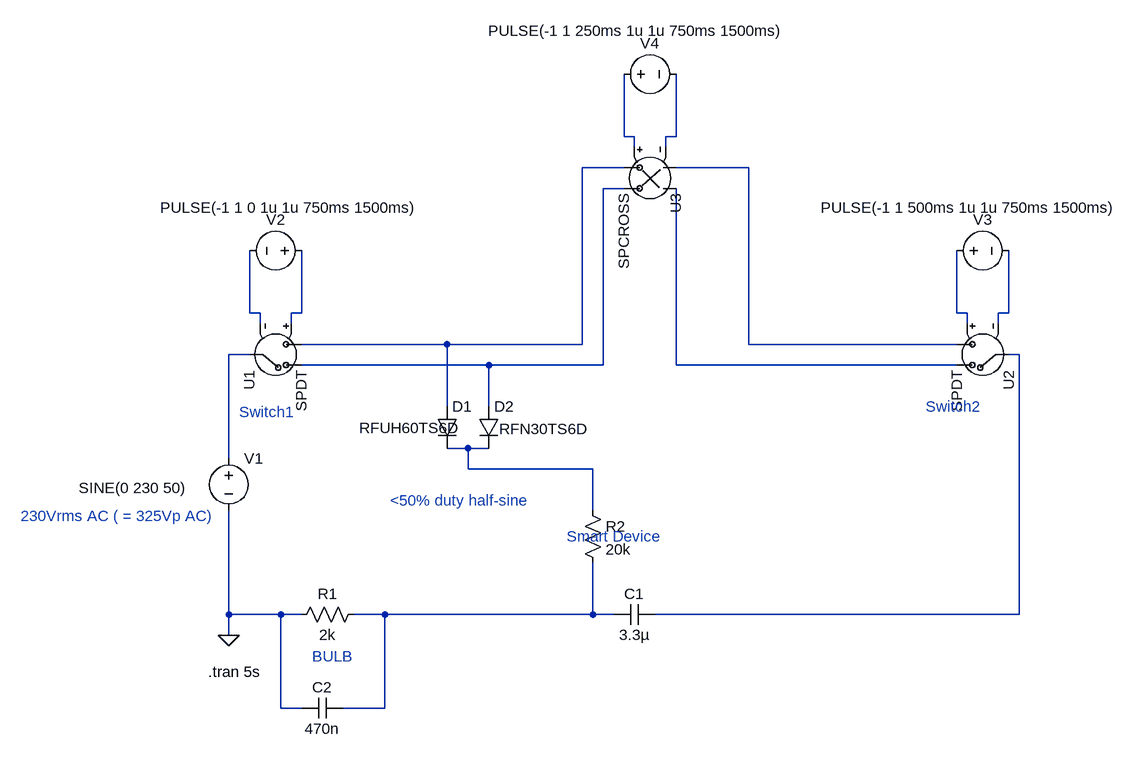
[diagram p0: schematic smartsw_alternate.asc]
smartsw_alternate.asc, the LTspice schematic file:
Version 4
SHEET 1 1208 680
WIRE 432 -528 432 -624
WIRE 448 -528 432 -528
WIRE 512 -528 512 -624
WIRE 512 -528 496 -528
WIRE 448 -512 448 -528
WIRE 496 -512 496 -528
WIRE 432 -480 368 -480
WIRE 624 -480 512 -480
WIRE 432 -448 400 -448
WIRE -144 -256 -144 -352
WIRE -128 -256 -144 -256
WIRE -64 -256 -64 -352
WIRE -64 -256 -80 -256
WIRE 944 -256 944 -352
WIRE 960 -256 944 -256
WIRE 1024 -256 1024 -352
WIRE 1024 -256 1008 -256
WIRE -128 -240 -128 -256
WIRE -80 -240 -80 -256
WIRE 960 -240 960 -256
WIRE 1008 -240 1008 -256
WIRE 160 -208 -64 -208
WIRE 368 -208 368 -480
WIRE 368 -208 160 -208
WIRE 624 -208 624 -480
WIRE 944 -208 624 -208
WIRE -144 -192 -176 -192
WIRE 1040 -192 1024 -192
WIRE 224 -176 -64 -176
WIRE 400 -176 400 -448
WIRE 400 -176 224 -176
WIRE 512 -176 512 -448
WIRE 944 -176 512 -176
WIRE 160 -112 160 -208
WIRE 224 -112 224 -176
WIRE 192 -48 160 -48
WIRE 224 -48 192 -48
WIRE -176 -32 -176 -192
WIRE 192 -16 192 -48
WIRE 384 -16 192 -16
WIRE 384 48 384 -16
WIRE -176 208 -176 48
WIRE -96 208 -176 208
WIRE -64 208 -96 208
WIRE 64 208 16 208
WIRE 384 208 384 128
WIRE 384 208 64 208
WIRE 416 208 384 208
WIRE 1040 208 1040 -192
WIRE 1040 208 480 208
WIRE -176 240 -176 208
WIRE -96 352 -96 208
WIRE -64 352 -96 352
WIRE 64 352 64 208
WIRE 64 352 0 352
FLAG -176 240 0
SYMBOL diode 144 -112 R0
WINDOW 3 -119 33 Left 2
SYMATTR Value RFUH60TS6D
SYMATTR InstName D1
SYMBOL voltage -176 -48 R0
WINDOW 3 -231 61 Left 2
WINDOW 123 0 0 Left 0
WINDOW 39 0 0 Left 0
SYMATTR Value SINE(0 230 50)
SYMATTR InstName V1
SYMBOL res 32 192 R90
WINDOW 0 0 56 VBottom 2
WINDOW 3 32 56 VTop 2
SYMATTR InstName R1
SYMATTR Value 2k
SYMBOL spdt -160 -192 M90
SYMATTR InstName U1
SYMBOL voltage -48 -352 R90
WINDOW 0 -32 56 VBottom 2
WINDOW 3 -82 35 VTop 2
WINDOW 123 0 0 Left 0
WINDOW 39 0 0 Left 0
SYMATTR InstName V2
SYMATTR Value PULSE(-1 1 0 1u 1u 750ms 1500ms)
SYMBOL diode 208 -112 R0
WINDOW 3 32 34 Left 2
SYMATTR Value RFN30TS6D
SYMATTR InstName D2
SYMBOL res 368 32 R0
SYMATTR InstName R2
SYMATTR Value 20k
SYMBOL spdt 1040 -192 R90
SYMATTR InstName U2
SYMBOL voltage 928 -352 M90
WINDOW 0 -32 56 VBottom 2
WINDOW 3 -82 35 VTop 2
WINDOW 123 0 0 Left 0
WINDOW 39 0 0 Left 0
SYMATTR InstName V3
SYMATTR Value PULSE(-1 1 500ms 1u 1u 750ms 1500ms)
SYMBOL cap 480 192 R90
WINDOW 0 0 32 VBottom 2
WINDOW 3 32 32 VTop 2
SYMATTR InstName C1
SYMATTR Value 3.3µ
SYMBOL cap 0 336 R90
WINDOW 0 0 32 VBottom 2
WINDOW 3 32 32 VTop 2
SYMATTR InstName C2
SYMATTR Value 470n
SYMBOL spcross 528 -464 R90
SYMATTR InstName U3
SYMBOL voltage 416 -624 M90
WINDOW 0 -32 56 VBottom 2
WINDOW 3 -82 35 VTop 2
WINDOW 123 0 0 Left 0
WINDOW 39 0 0 Left 0
SYMATTR InstName V4
SYMATTR Value PULSE(-1 1 250ms 1u 1u 750ms 1500ms)
TEXT -48 272 Left 2 ;BULB
TEXT 344 88 Left 2 ;Smart Device
TEXT -160 -104 Left 2 ;Switch1
TEXT 896 -112 Left 2 ;Switch2
TEXT -208 296 Left 2 !.tran 5s
TEXT -496 56 Left 2 ;230Vrms AC ( = 325Vp AC)
TEXT 72 32 Left 2 ;<50% duty half-sine

The netlist it stands for:
* smartsw_alternate.asc
D1 N003 N013 RFUH60TS6D
V1 N010 0 SINE(0 230 50)
R1 N014 0 2k
XU1 N010 N003 N005 N007 N006 SPDT  ; pins A B C NC+ NC-
V2 N007 N006 PULSE(-1 1 0 1u 1u 750ms 1500ms)
D2 N005 N013 RFN30TS6D
R2 N013 N014 20k
XU2 N011 N004 N012 N008 N009 SPDT  ; pins A B C NC+ NC-
V3 N008 N009 PULSE(-1 1 500ms 1u 1u 750ms 1500ms)
C1 N011 N014 3.3µ
C2 N014 0 470n
XU3 N004 N012 N003 N005 N001 N002 SPCROSS  ; pins IN1 IN2 O1 O2 NC+ NC-
V4 N001 N002 PULSE(-1 1 250ms 1u 1u 750ms 1500ms)
.model D D
.lib standard.dio
* BULB
* Smart Device
* Switch1
* Switch2
.tran 5s
* 230Vrms AC ( = 325Vp AC)
* <50% duty half-sine
.lib spdt.lib
.lib spcross.lib
.backanno
.end